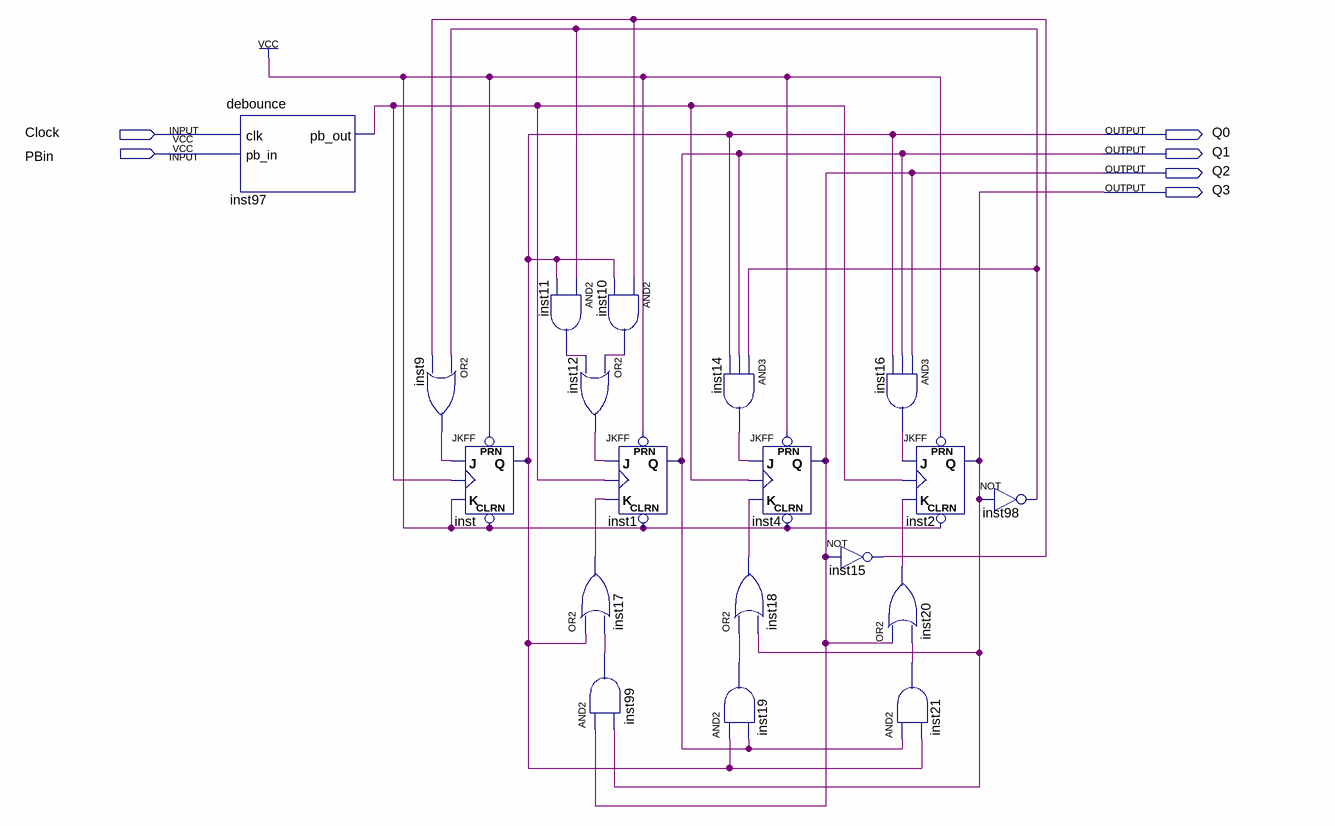
[diagram p0: schematic sheet]
// Quartus schematic TEST2.bdf as structural Verilog: 19 symbols, 6 pins
module TEST2 (
  input  Clock,
  input  PBin,
  output Q0,
  output Q1,
  output Q2,
  output Q3
);

  wire inst9_out, inst10_out, inst11_out, inst12_out, inst14_out, inst15_out, inst16_out, inst17_out,
       inst18_out, inst19_out, inst20_out, inst21_out, inst97_pb_out, inst98_out, inst99_out;

  debounce inst97 (.clk(Clock), .pb_in(PBin), .pb_out(inst97_pb_out));
  or inst9 (inst9_out, inst98_out, inst15_out);
  JKFF inst (.PRN(1'b1), .CLRN(1'b1), .K(1'b1), .J(inst9_out), .CLK(inst97_pb_out), .Q(Q0));
  and inst10 (inst10_out, inst15_out, Q0);
  and inst11 (inst11_out, inst98_out, Q0);
  or inst12 (inst12_out, inst10_out, inst11_out);
  or inst17 (inst17_out, Q0, inst99_out);
  and inst99 (inst99_out, Q2, Q3);
  JKFF inst1 (.PRN(1'b1), .CLRN(1'b1), .K(inst17_out), .J(inst12_out), .CLK(inst97_pb_out), .Q(Q1));
  and inst14 (inst14_out, inst98_out, Q1, Q0);
  JKFF inst4 (.PRN(1'b1), .CLRN(1'b1), .K(inst18_out), .J(inst14_out), .CLK(inst97_pb_out), .Q(Q2));
  or inst18 (inst18_out, inst19_out, Q3);
  and inst19 (inst19_out, Q0, Q1);
  not inst15 (inst15_out, Q2);
  and inst16 (inst16_out, Q2, Q1, Q0);
  JKFF inst2 (.PRN(1'b1), .CLRN(1'b1), .K(inst20_out), .J(inst16_out), .CLK(inst97_pb_out), .Q(Q3));
  or inst20 (inst20_out, Q2, inst21_out);
  and inst21 (inst21_out, Q1, Q0);
  not inst98 (inst98_out, Q3);
endmodule
